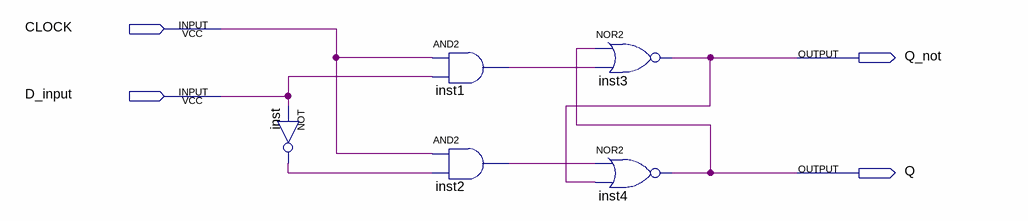
[diagram p0: schematic sheet]
// Quartus schematic First_DFF.bdf as structural Verilog: 5 symbols, 4 pins
module First_DFF (
  input  CLOCK,
  input  D_input,
  output Q_not,
  output Q
);

  wire inst1_out, inst2_out, inst_out;

  not inst (inst_out, D_input);
  and inst1 (inst1_out, CLOCK, D_input);
  and inst2 (inst2_out, CLOCK, inst_out);
  nor inst3 (Q_not, Q, inst1_out);
  nor inst4 (Q, inst2_out, Q_not);
endmodule
